# Altium schematic sheet can_3v3_0603_ti.SchDoc
size A
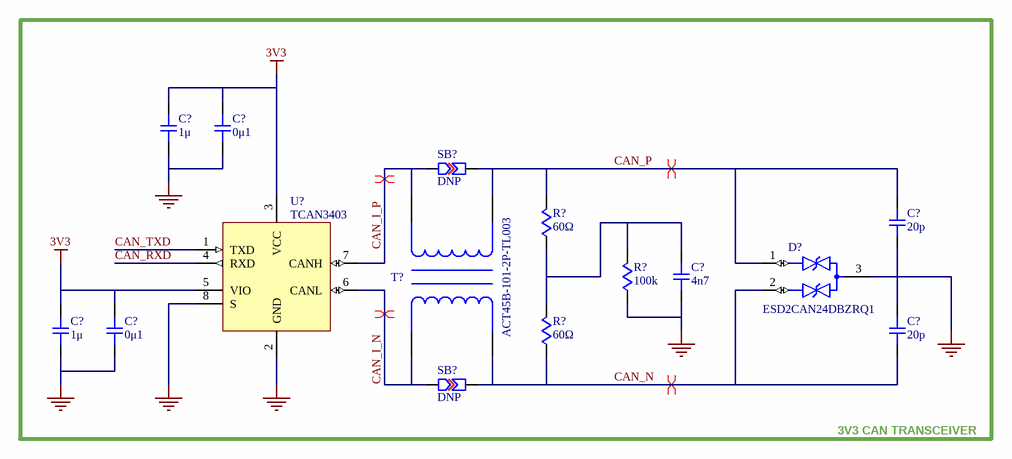
[diagram p0: can_3v3_0603_ti.SchDoc]

## Parts
(Parts that share a designator on the sheet are numbered #1, #2 ... from top to bottom, then left to right.)
C?#1  1μ  [cap_0603]
C?#2  0μ1  [cap_0603]
C?#3  20p  [cap_0603]
C?#4  4n7  [cap_0603]
C?#5  1μ  [cap_0603]
C?#6  0μ1  [cap_0603]
C?#7  20p  [cap_0603]
D?  ESD2CAN24DBZRQ1  [ESD2CAN]
R?#1  60Ω  [res_0805]
R?#2  100k  [res_0603]
R?#3  60Ω  [res_0805]
SB?#1  DNP  [solder_bridge_triangular_0603_DNP]
SB?#2  DNP  [solder_bridge_triangular_0603_DNP]
T?  ACT45B-101-2P-TL003  [ind_transformer_act45b]
U?  TCAN3403  [TCAN3403DDFRQ1]

## Blocks framed on the sheet
3V3 CAN TRANSCEIVER: C?#1-C?#7 D? R?#1-R?#3 SB?#1 SB?#2 T? U?

## Nets
3V3: C?#1.2 C?#2.2 C?#5.2 C?#6.2 U?.3(VCC) U?.5(VIO)
GND: C?#1.1 C?#2.1 C?#3.1 C?#4.1 C?#5.1 C?#6.1 C?#7.2 D?.3(GND) R?#2.1 U?.2(GND) U?.8(S)
CAN_I_N: SB?#2.1 U?.6(CANL)
CAN_I_P: SB?#1.1 T?.1 U?.7(CANH)
CAN_N: C?#7.1 D?.2(IO2) R?#3.1 SB?#2.2 T?.3
CAN_P: C?#3.2 D?.1(IO1) R?#1.2 SB?#1.2 T?.4
CAN_RXD: U?.4(RXD)
CAN_TXD: U?.1(TXD)
NetC?#4_2: C?#4.2 R?#1.1 R?#2.2 R?#3.2

Not connected (* = marked no-connect by the designer): T? 2

## Layout directives
differential pair: CAN_I_N, CAN_I_P, CAN_N, CAN_P

## Library data of the parts
C?#1-C?#7 = CAP_0603: Capacitor SMD 0603; Manufacturer: *; Manufacturer Part Number: *; Distributor Link: *; LCSC: *; Rating: *; Dielectric: *
D? = ESD2CAN: 37V (Typ) Clamp 5.7A (8/20µs) Ipp Tvs Diode Surface Mount SOT-23-3
R?#1 R?#3 = res_0805: Resistor SMD 0805
R?#2 = res_0603: Resistor SMD 0603
SB?#1 SB?#2 = solder_bridge_triangular_0603_DNP: DNP Open Solder Bridge Triangular 0603 DO NOT POPULATE
T? = ind_transformer_act45b: 100 µH @ 100 kHz 2 Line Common Mode Choke Surface Mount 5.8 kOhms @ 10 MHz 150mA DCR 2Ohm
U? = TCAN3403DDFRQ1: CAN Transciever Hald CANbus TSOT-23-8